# Altium project UC3842_SMPS_12V_5A_V2.PrjPcb
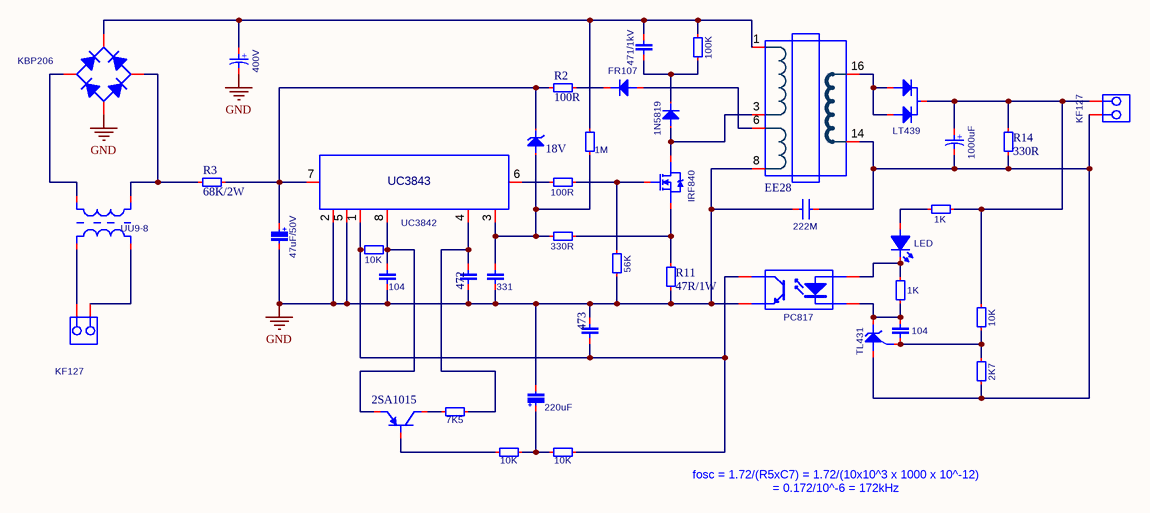
[diagram p0: UC3842_SMPS_12V_5A_V2.SchDoc]
1 sheet, 43 parts. Net scope: global (net labels, ports and power ports of the same name join across sheets).
Board files: UC3842_SMPS_12V_5A_V2.PcbDoc, PCB1.PcbDoc

## Sheet UC3842_SMPS_12V_5A_V2.SchDoc
size A4; SheetNumber: 1; SheetTotal: 1

### Parts
C1  47uF/50V  [CAP_RAD_2.5mm]
C2  400V  [CAP_RAD_D12.5x15_POL_BK]
C3  471/1kV  [CAP_DISC_4x3_YL]
C4  1000uF  [CAP_RAD_D10x12.5_POL_BK]
C5  222M  [CAP_DISC_Y2222]
C6  104  [CAP_Ceramic_Disc_2]
C7  472  [CAP_DISC_4x3_YL]
C8  331  [CAP_DISC_4x3_YL]
C9  104  [CAP_DISC_4x3_YL]
C10  473  [CAP_DISC_4x3_YL]
C11  220uF  [CAP_RAD_2.5mm]
D1  LT439  [TO-220-HEAT-SINK-1]
D2  KBP206  [DIODE-KBP206]
D3  18V  [DO-204AL-RD]
D4  1N5819  [DO-204AL-BK]
D7  LED  [LED_3MM_GREEN]
D8  FR107  [DO-204AL-BK]
IC1  UC3842  [DIP-8]
J1  KF127  [DG127-5.0-02P-14-00AH]
J2  KF127  [DG127-5.0-02P-14-00AH]
Q1  IRF840  [TO-220-HEAT-SINK-1]
Q2  2SA1015  [TO-92]
R1  100K  [RES-0.25W-H-CF]
R2  100R  [RES-0.5W-H]
R3  68K/2W  [RES-2W-H]
R4  1K  [RES-0.25W-H-CF]
R5  7K5  [RES-0.25W-H-CF]
R6  100R  [RES-0.25W-H-CF]
R7  1K  [RES-0.25W-V-CF]
R8  330R  [RES-0.25W-H-CF]
R9  10K  [RES-0.25W-H-CF]
R10  56K  [RES-0.25W-H-CF]
R11  47R/1W  [RES-1W-H]
R12  2K7  [RES-0.25W-H-CF]
R13  1M  [RES-0.25W-H-CF]
R14  330R  [RES-1W-V]
R15  10K  [RES-0.25W-H-CF]
R16  10K  [RES-0.25W-H-CF]
R17  10K  [RES-0.25W-H-CF]
T1  EE28  [TRANSFORMER-EE28-VERTICAL(8+8)]
T2  UU9-8  [INDUCTOR-BOBBIN-UF9-8]
U1  PC817  [PC817-DIP]
U2  TL431  [TO-92]

### Nets
GND: C1.2 C2.2 C5.1 C6.2 C7.1 C8.2 C10.2 C11.2 D2.4(-) IC1.2(VFB) IC1.5(GND) R10.1 R11.1 T1.8 U1.3(E)
NetC1_1: C1.1 D3.2 IC1.7(VCC) R2.1 R3.2
NetC2_1: C2.1 C3.1 D2.1(+) R1.2 R13.1 T1.1
NetC3_2: C3.2 D4.2 R1.1
NetC4_1: C4.1 D1.2 J2.2 R4.1 R9.1 R14.2
NetC4_2: C4.2 C5.2 J2.1 R12.2 R14.1 T1.14 U2.2
NetC6_1: C6.1 IC1.8(VREF) Q2.1(E) R15.2
NetC7_2: C7.2 IC1.4(RT/CT) R5.1
NetC8_1: C8.1 D3.1 IC1.3(CS) R8.1 R13.2
NetC9_1: C9.1 R9.2 R12.1 U2.1
NetC9_2: C9.2 R7.2 U1.2(K) U2.3
NetC10_1: C10.1 IC1.1(COMP) R15.1 R17.1 U1.4(C)
NetC11_1: C11.1 R16.1 R17.2
NetD1_1: D1.1 D1.3 T1.16
NetD2_2: D2.2(AC) T2.2
NetD2_3: D2.3(AC) R3.1 T2.4
NetD4_1: D4.1 Q1.2(D) T1.3
NetD7_1: D7.1(A) R4.2
NetD7_2: D7.2(K) R7.1 U1.1(A)
NetD8_1: D8.1 T1.6
NetD8_2: D8.2 R2.2
NetIC1_6: IC1.6(OUT) R6.1
NetJ1_1: J1.1 T2.1
NetJ1_2: J1.2 T2.3
NetQ1_1: Q1.1(G) R6.2 R10.2
NetQ1_3: Q1.3(S) R8.2 R11.2
NetQ2_2: Q2.2(C) R5.2
NetQ2_3: Q2.3(B) R16.2

### Notes on the sheet
- fosc = 1.72/(R5xC7) = 1.72/(10x10^3 x 1000 x 10^-12)
  = 0.172/10^-6 = 172kHz
- (in symbol Capacitor(Radian)) +
- (in symbol SMPS-UC3842) UC3843

### Library data of the parts
C1 C2 C4 C11 = Capacitor(Radian)
C3 C5-C10 = Capacitors(Disc)
D1 = Diode-LT439
D2 = Diode-KBP206
D3 = Diode-Zener
D4 D8 = Diode-1N5819: 1A - Schotky Diode
D7 = LED 3MM
IC1 = SMPS-UC3842
J1 J2 = DG127-5.0-02P-14-00AH
Q1 = Mosfet-IRF840
Q2 = Transistor-2SA1015 (TO-92)
R1-R17 = Resistors THD
T1 = TRANS-EE28-13-7-VERTICAL(8+8)
T2 = Inductor-UU9-8
U1 = Opto-PC817
U2 = Ic-TL431